# EAGLE schematic Digital Clock v2 (EAGLE 7.5.0)
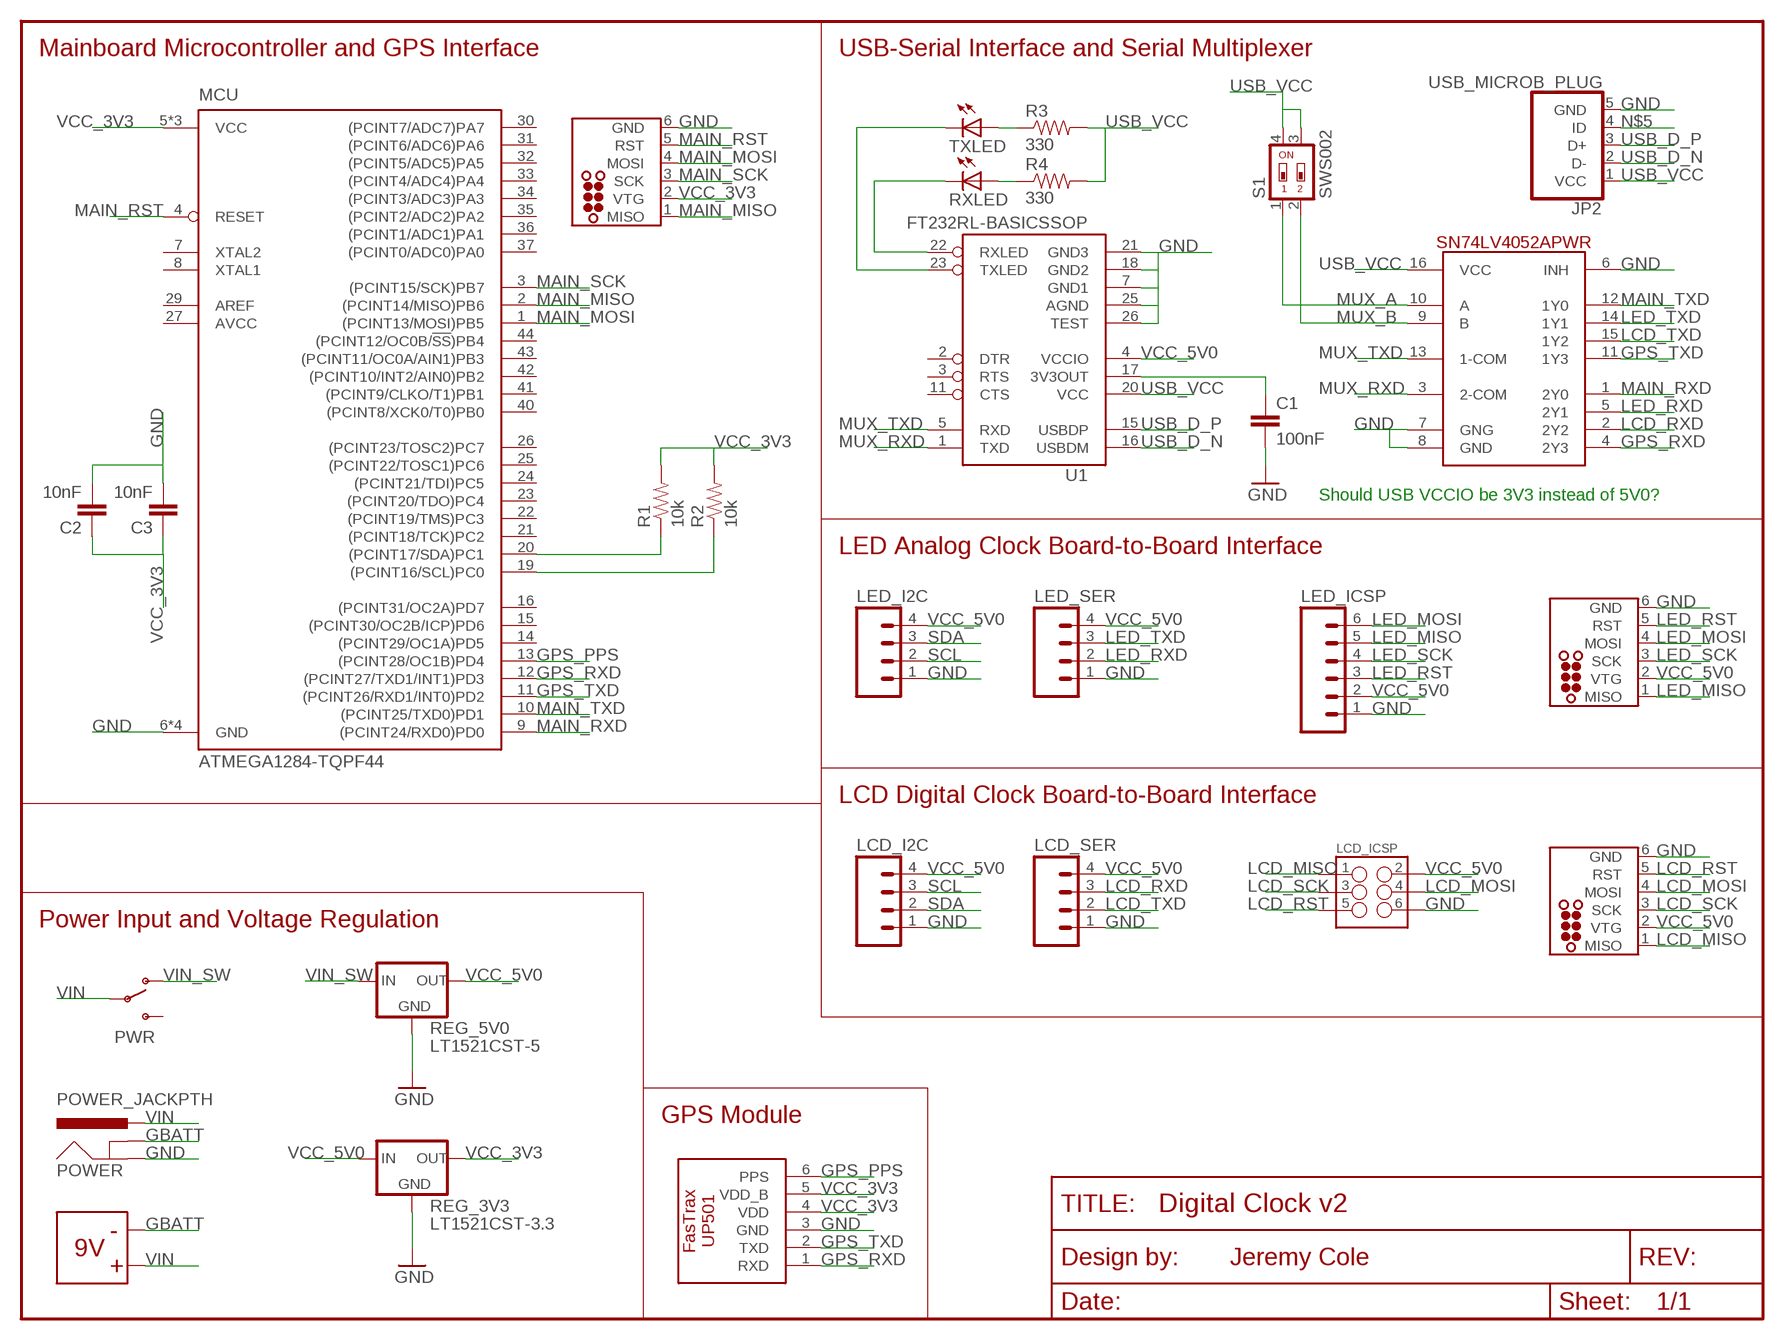
[diagram p0: schematic, sheet 1]

## Parts
9V_BATTERY  BATTERY-BH9VGLUE  [BATTERY-BH9V-GLUE]
C1  100nF  CAP-0603  [0603-CAP]
C2  10nF  CAP-0603  [0603-CAP]
C3  10nF  CAP-0603  [0603-CAP]
FRAME1  FRAME-LETTERNO_PACKAGE  [DUMMY]
GPS_ICSP_TC  TC2030-AVR-NL  [TC2030-NL]
JP2  USB_MICROB_PLUG  [USB_MICRO_B_TYCO]
LCD_I2C  M04LONGPADS  [1X04_LONGPADS]
LCD_ICSP  M03X22X3_SILK_MALE_PTH  [2X3]
LCD_ICSP_TC  TC2030-AVR-NL  [TC2030-NL]
LCD_SER  M04LONGPADS  [1X04_LONGPADS]
LED_I2C  M04LONGPADS  [1X04_LONGPADS]
LED_ICSP  M06LONGPADS  [1X06_LONGPADS]
LED_ICSP_TC  TC2030-AVR-NL  [TC2030-NL]
LED_SER  M04LONGPADS  [1X04_LONGPADS]
MCU  ATMEGA1284-TQPF44  [TQFP44]
POWER  POWER_JACKPTH  [POWER_JACK_PTH]
PWR  SWITCH-SPSTPTH  [SWITCH-SPDT]
R1  10k  RESISTOR-0603  [0603]
R2  10k  RESISTOR-0603  [0603]
R3  330  RESISTOR-0603  [0603]
R4  330  RESISTOR-0603  [0603]
REG_3V3  LT1521CST-3.3  LT1521  [SOT223]
REG_5V0  LT1521CST-5  LT1521  [SOT223]
RXLED  LED-0603  [0603-LED]
S1  SWS002  [SMS-002]
TXLED  LED-0603  [0603-LED]
U1  FT232RL-BASICSSOP  [SSOP28DB]
U$15  FASTRAX-UP501  [FASTRAX-UP501]
U$16  SV74LV4052APWR  [TSSOP16]

## Nets
GBATT [supply]: 9V_BATTERY.9V- POWER.GNDBREAK
GND [supply]: C1.2 C2.2 C3.2 GPS_ICSP_TC.6(GND) JP2.5(GND) LCD_I2C.1 LCD_ICSP.6 LCD_ICSP_TC.6(GND) LCD_SER.1 LED_I2C.1 LED_ICSP.1 LED_ICSP_TC.6(GND) LED_SER.1 MCU.6(GND) MCU.18(GND) MCU.28(GND) MCU.39(GND) POWER.GND REG_3V3.2(GND) REG_3V3.TAB(GND) REG_5V0.2(GND) REG_5V0.TAB(GND) U1.7(GND1) U1.18(GND2) U1.21(GND3) U1.25(AGND) U1.26(TEST) U$15.3(GND) U$16.6(INH) U$16.7(GNG) U$16.8(GND)
GPS_PPS: MCU.13((PCINT28/OC1B)PD4) U$15.6(PPS)
GPS_RXD: MCU.12((PCINT27/TXD1/INT1)PD3) U$15.1(RXD) U$16.4(2Y3)
GPS_TXD: MCU.11((PCINT26/RXD1/INT0)PD2) U$15.2(TXD) U$16.11(1Y3)
LCD_MISO: LCD_ICSP.1 LCD_ICSP_TC.1(MISO)
LCD_MOSI: LCD_ICSP.4 LCD_ICSP_TC.4(MOSI)
LCD_RST: LCD_ICSP.5 LCD_ICSP_TC.5(RST)
LCD_RXD: LCD_SER.3 U$16.2(2Y2)
LCD_SCK: LCD_ICSP.3 LCD_ICSP_TC.3(SCK)
LCD_TXD: LCD_SER.2 U$16.15(1Y2)
LED_MISO: LED_ICSP.5 LED_ICSP_TC.1(MISO)
LED_MOSI: LED_ICSP.6 LED_ICSP_TC.4(MOSI)
LED_RST: LED_ICSP.3 LED_ICSP_TC.5(RST)
LED_RXD: LED_SER.2 U$16.5(2Y1)
LED_SCK: LED_ICSP.4 LED_ICSP_TC.3(SCK)
LED_TXD: LED_SER.3 U$16.14(1Y1)
MAIN_MISO: GPS_ICSP_TC.1(MISO) MCU.2((PCINT14/MISO)PB6)
MAIN_MOSI: GPS_ICSP_TC.4(MOSI) MCU.1((PCINT13/MOSI)PB5)
MAIN_RST: GPS_ICSP_TC.5(RST) MCU.4(RESET)
MAIN_RXD: MCU.9((PCINT24/RXD0)PD0) U$16.1(2Y0)
MAIN_SCK: GPS_ICSP_TC.3(SCK) MCU.3((PCINT15/SCK)PB7)
MAIN_TXD: MCU.10((PCINT25/TXD0)PD1) U$16.12(1Y0)
MUX_A: S1.1 U$16.10(A)
MUX_B: S1.2 U$16.9(B)
MUX_RXD: U1.1(TXD) U$16.3(2-COM)
MUX_TXD: U1.5(RXD) U$16.13(1-COM)
N$1: R3.1 TXLED.A
N$2: R4.1 RXLED.A
N$4: C1.1 U1.17(3V3OUT)
N$5: JP2.4(ID)
N$7: TXLED.C U1.23(TXLED)
N$17: RXLED.C U1.22(RXLED)
SCL: LCD_I2C.3 LED_I2C.2 MCU.19((PCINT16/SCL)PC0) R2.1
SDA: LCD_I2C.2 LED_I2C.3 MCU.20((PCINT17/SDA)PC1) R1.1
USB_D_N: JP2.2(D-) U1.16(USBDM)
USB_D_P: JP2.3(D+) U1.15(USBDP)
USB_VCC: JP2.1(VCC) R3.2 R4.2 S1.3 S1.4 U1.20(VCC) U$16.16(VCC)
VCC_3V3 [supply]: C2.1 C3.1 GPS_ICSP_TC.2(VTG) MCU.5(VCC) MCU.17(VCC) MCU.38(VCC) R1.2 R2.2 REG_3V3.3(OUT) U$15.4(VDD) U$15.5(VDD_B)
VCC_5V0 [supply]: LCD_I2C.4 LCD_ICSP.2 LCD_ICSP_TC.2(VTG) LCD_SER.4 LED_I2C.4 LED_ICSP.2 LED_ICSP_TC.2(VTG) LED_SER.4 REG_3V3.1(IN) REG_5V0.3(OUT) U1.4(VCCIO)
VIN [supply]: 9V_BATTERY.9V+ POWER.PWR PWR.2(P)
VIN_SW [supply]: PWR.1(O) REG_5V0.1(IN)
Unconnected: MCU.7(XTAL2) MCU.8(XTAL1) MCU.14((PCINT29/OC1A)PD5) MCU.15((PCINT30/OC2B/ICP)PD6) MCU.16((PCINT31/OC2A)PD7) MCU.21((PCINT18/TCK)PC2) MCU.22((PCINT19/TMS)PC3) MCU.23((PCINT20/TDO)PC4) MCU.24((PCINT21/TDI)PC5) MCU.25((PCINT22/TOSC1)PC6) MCU.26((PCINT23/TOSC2)PC7) MCU.29(AREF) MCU.30((PCINT7/ADC7)PA7) MCU.31((PCINT6/ADC6)PA6) MCU.32((PCINT5/ADC5)PA5) MCU.33((PCINT4/ADC4)PA4) MCU.34((PCINT3/ADC3)PA3) MCU.35((PCINT2/ADC2)PA2) MCU.36((PCINT1/ADC1)PA1) MCU.37((PCINT0/ADC0)PA0) MCU.40((PCINT8/XCK0/T0)PB0) MCU.41((PCINT9/CLKO/T1)PB1) MCU.42((PCINT10/INT2/AIN0)PB2) MCU.43((PCINT11/OC0A/AIN1)PB3) MCU.44((PCINT12/OC0B/!SS!)PB4) PWR.3(S) U1.2(DTR) U1.3(RTS) U1.11(CTS)

## Notes on the sheet
- Mainboard Microcontroller and GPS Interface | USB-Serial Interface and Serial Multiplexer
- Should USB VCCIO be 3V3 instead of 5V0?
- LED Analog Clock Board-to-Board Interface
- LCD Digital Clock Board-to-Board Interface
- Power Input and Voltage Regulation
- GPS Module
- Jeremy Cole

## Power pins joined to a net without a drawn wire
AVCC: MCU.27(AVCC)

## Library data of the parts
9V_BATTERY = jcole:BATTERY-BH9V: Battery holder for 9V batteries, Digikey PN BH9V-PC-ND
C1-C3 = jcole:CAP: Capacitor Standard 0603 ceramic capacitor, and 0.1" leaded capacitor.
FRAME1 = jcole:FRAME-LETTER: Schematic Frame Standard 8.5x11 US Letter frame; DESIGNER: Nobody; VERSION: v01
GPS_ICSP_TC LCD_ICSP_TC LED_ICSP_TC = jcole:TC2030-AVR: TAG-CONNECT ICSP Connector (AVR 6-pin) Manufacturer: Tag-Connect <http://www.tag-connect.com> Cable for easy In-Circuit Serial Programming. Two variants: one "with legs" (-L) for hands-free fit on PCB, and another "without legs" (-NL) for quick programming. PAD Description 1 MISO 2 VTG 3 SCK 4 MOSI 5 RST 6 GND © 2013 Jeremy Cole <jeremy@jcole.us>. Based on MCP variant by Robert Darlington <rdarlington@gmail.com>
JP2 = jcole:USB_MICROB_PLUG: USB Micro-B Plug Comes in a variety of packages. Check out Hirose's ZX-x0 line: http://www.hirose.co.jp/cataloge_hp/e24200011.pdf
LCD_I2C LCD_SER LED_I2C LED_SER = SparkFun:M04: Header 4 Standard 4-pin 0.1" header. Use with straight break away headers (SKU : PRT-00116), right angle break away headers (PRT-00553), swiss pins (PRT-00743), machine pins (PRT-00117), and female headers (PRT-00115). Molex polarized connector foot print use with SKU : PRT-08231 with associated crimp pins and housings.
LCD_ICSP = SparkFun-Connectors:M03X2: 2x3 .1" header. Shrouded, with keying- CONN-10681 SMT- CONN-11415 Pogo pins- HW-11044; PROD_ID: CONN-09701
LED_ICSP = SparkFun-Connectors:M06: Header 6 Standard 6-pin 0.1" header. Use with straight break away headers (SKU : PRT-00116), right angle break away headers (PRT-00553), swiss pins (PRT-00743), machine pins (PRT-00117), and female headers (PRT-00115). Molex polarized connector foot print use with SKU : PRT-08094 with associated crimp pins and housings. NOTES ON THE VARIANTS LOCK and LOCK_LONGPADS... This footprint was designed to help hold the alignment of a through-hole component (i.e. 6-pin header) while soldering it into place. You may notice that each hole has been shifted either up or down by 0.005 of an inch from it's more standard position (which is a perfectly straight line). This slight alteration caused the pins (the squares in the middle) to touch the edges of the holes. Because they are alternating, it causes a "brace" to hold the component in place. 0.005 has proven to be the perfect amount of "off-center" position when using our standard breakaway headers. Although looks a little odd when you look at the bare footprint, once you have a header in there, the alteration is very hard to notice. Also,if you push a header all the way into place, it is covered up entirely on the bottom side. This idea of altering the position of holes to aid alignment will be further integrated into the Sparkfun Library for other footprints. It can help hold any component with 3 or more connection pins.
MCU = jcole:ATMEGA1284
POWER = SparkFun:POWER_JACK: Power Jack This is the standard 5.5mm barrel jack for power. The PTH is the most common, proven, reliable, footprint. All others are experimental. The Slot footprint only works if the mill layer is transmitted to the PCB fab house so be warned. Spark Fun Electronics SKU : PRT-00119. Mating wall wart : TOL-00298 (and others)
PWR = SparkFun:SWITCH-SPST: SPST Switch Simple slide switch. Spark Fun Electronics SKU : COM-00102
R1-R4 = jcole:RESISTOR: Resistor Basic schematic elements and footprints for 0603, 1206, and PTH resistors.
REG_3V3 REG_5V0 = jcole:LT1521
RXLED TXLED = jcole:LED: LEDs Standard schematic elements and footprints for 5mm, 3mm, 1206, and 0603 sized LEDs. 5mm - Spark Fun Electronics SKU : COM-00529 (and others)
S1 = smd-special:SWS002: SMD Dip Switch 2 pol.
U1 = SparkFun-DigitalIC:FT232RL-BASIC: USB UART This is the simplified version of the FT232RL unit. Only what you need, nothing you don't. Spark Fun Electronics SKU : COM-00650; PROD_ID: IC-00870
U$15 = jcole:FASTRAX-UP501
U$16 = SparkFun-AnalogIC:SV74LV4052APWR: Dual 4:1 analog mux

## Net classes
0 default: width 0.254 mm, clearance 0.205 mm
1 supply: width 0.254 mm, clearance 0.205 mm to class 0, clearance 0.205 mm